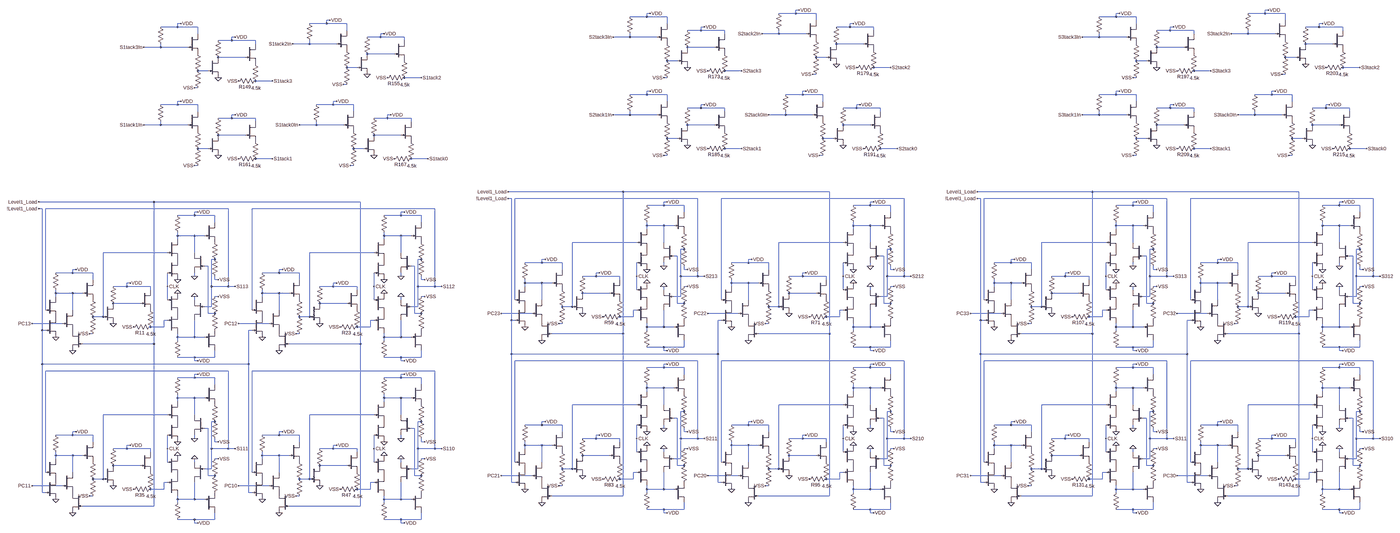
[diagram p0: schematic Level 1.asc, whole sheet]
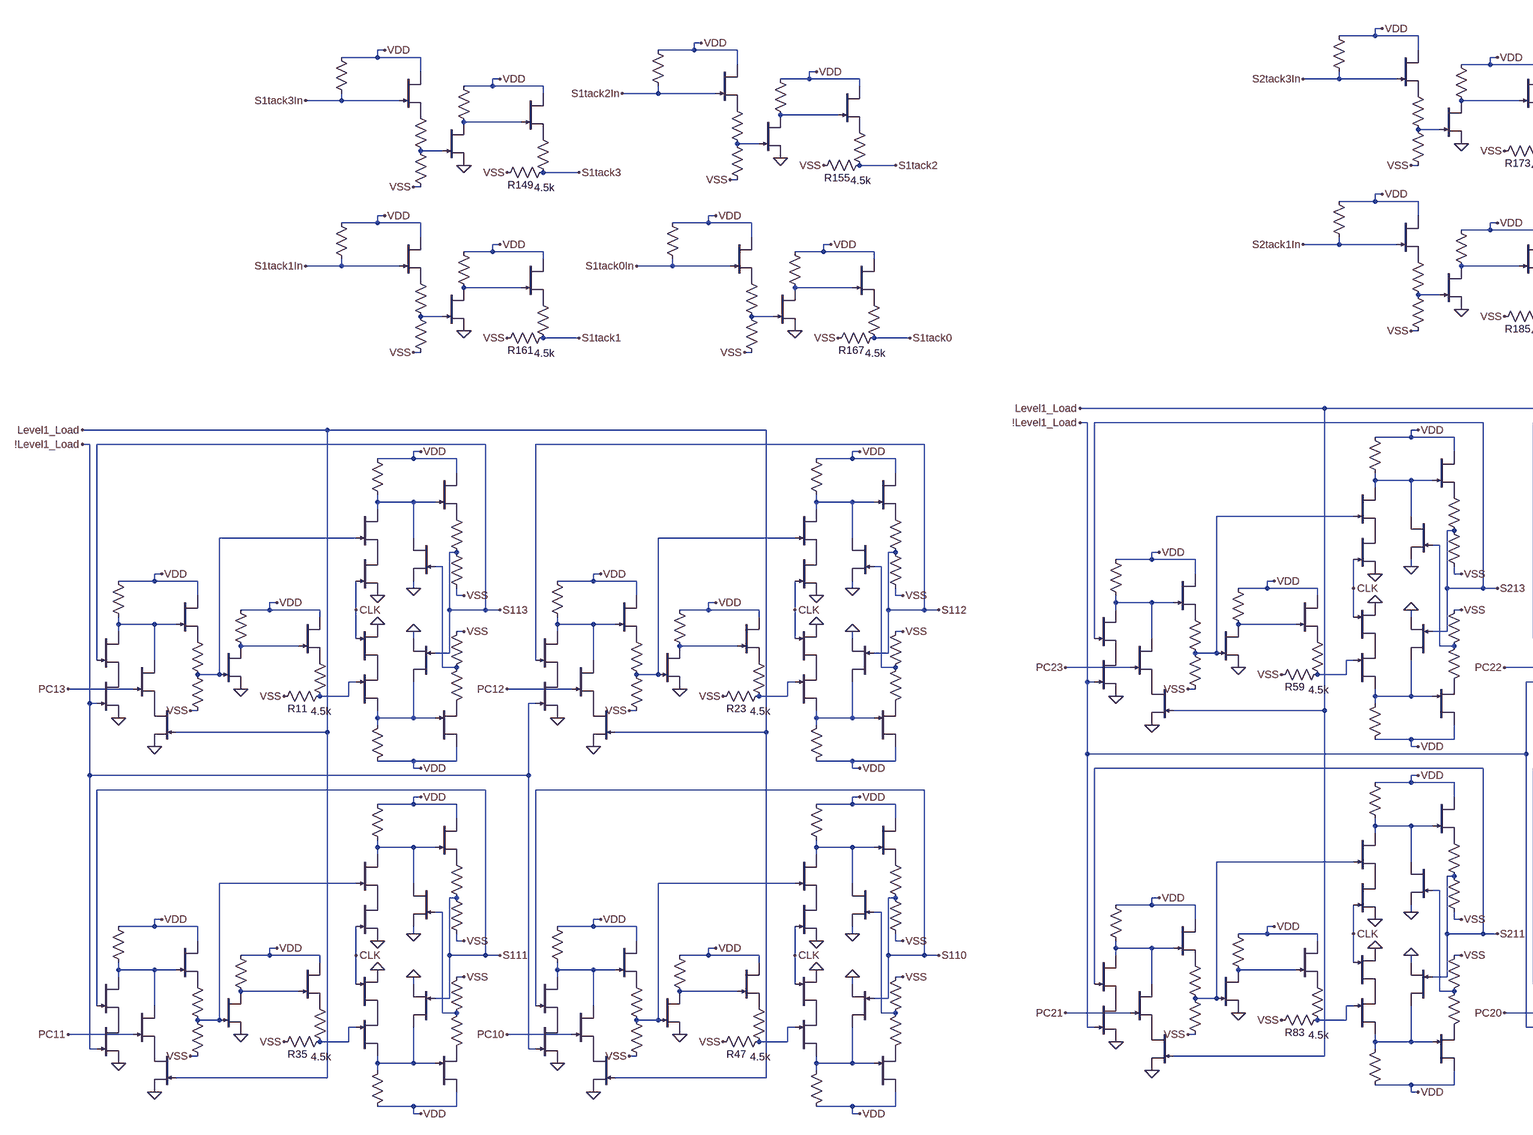
[diagram p1: schematic Level 1.asc, part, row 1 of 1, column 1 of 2]
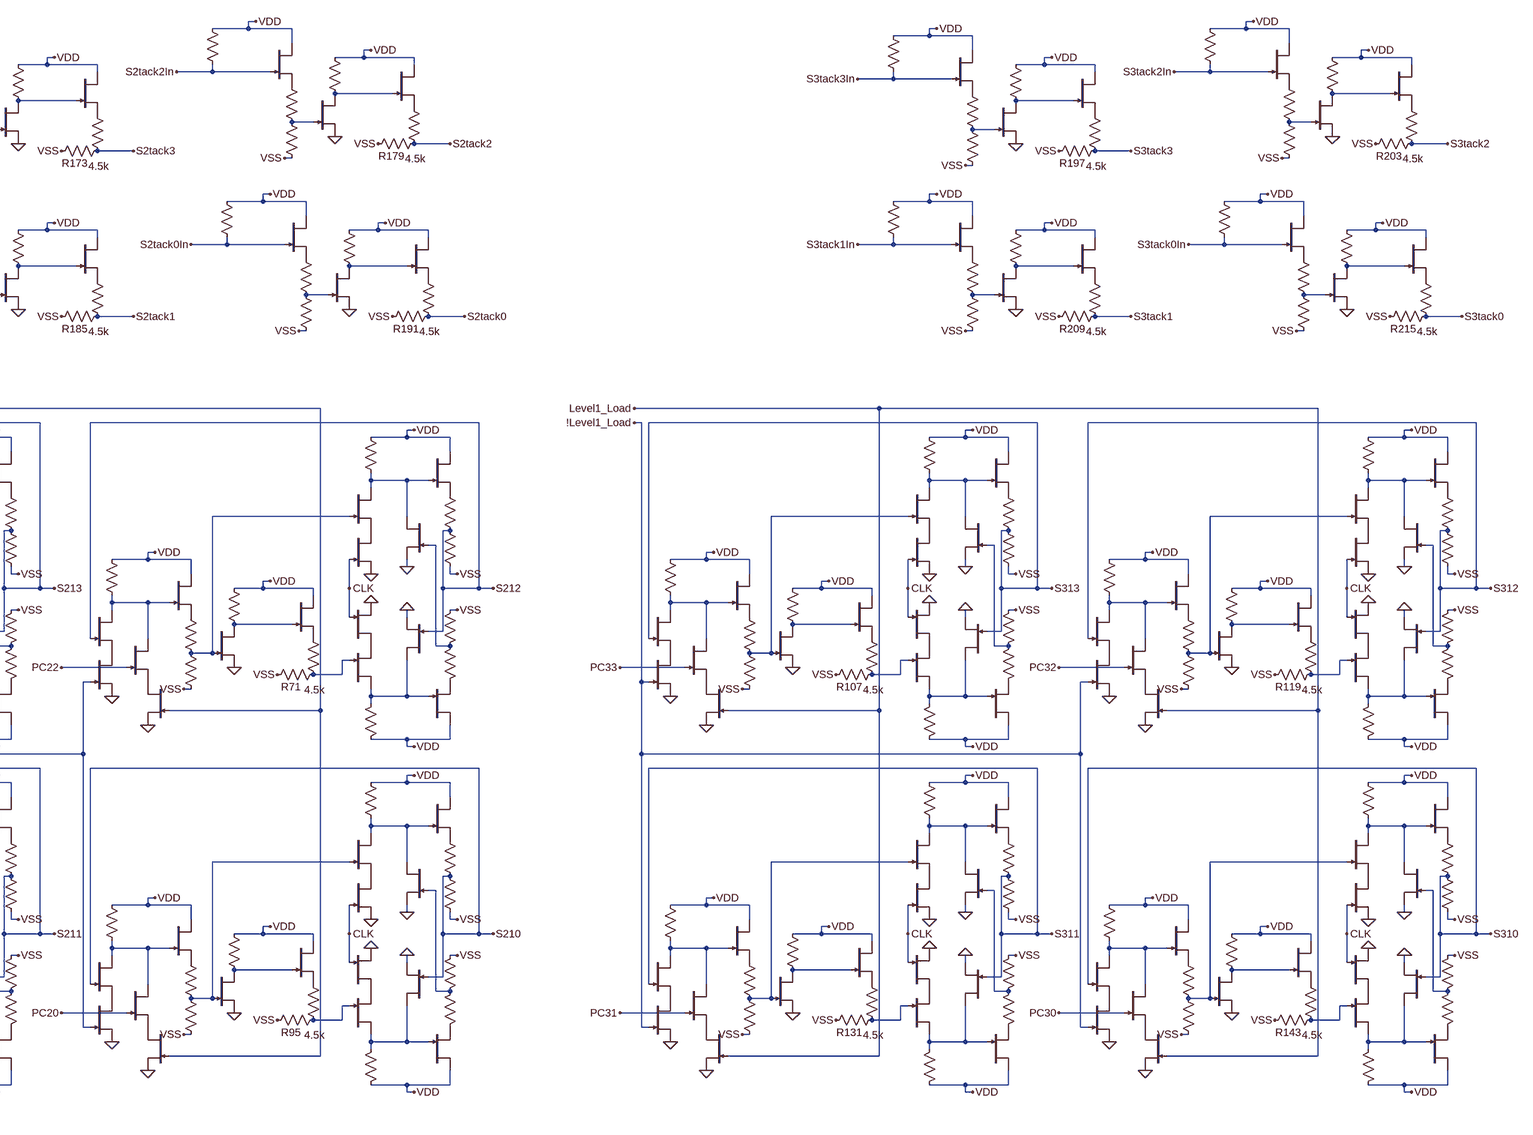
[diagram p2: schematic Level 1.asc, part, row 1 of 1, column 2 of 2]
* Level 1.asc
J0 N029 N035 P001 DR
R0 VDD N029 100k
J1 VDD N029 P002 DR
R1 P002 S113 1k
R2 S113 VSS 4.8k
J2 N029 N041 0 DR
J3 N065 N059 P003 DR
R3 VDD N065 100k
J4 VDD N065 P004 DR
R4 P004 N041 1k
R5 N041 VSS 4.8k
J5 N065 S113 0 DR
J6 P001 CLK 0 DR
J7 P003 CLK 0 DR
J8 N047 S113 P005 DR
R6 VDD N047 100k
J9 VDD N047 P006 DR
R7 P006 N035 1k
R8 N035 VSS 4.8k
J10 N047 PC13 P007 DR
J11 N053 N035 0 DR
R9 VDD N053 50k
J12 VDD N053 P008 DR
R10 P008 N059 1k
R11 N059 VSS 4.5k
J13 P005 !Level1_Load 0 DR
J14 P007 Level1_Load 0 DR
J15 N030 N036 P009 DR
R12 VDD N030 100k
J16 VDD N030 P010 DR
R13 P010 S112 1k
R14 S112 VSS 4.8k
J17 N030 N042 0 DR
J18 N066 N060 P011 DR
R15 VDD N066 100k
J19 VDD N066 P012 DR
R16 P012 N042 1k
R17 N042 VSS 4.8k
J20 N066 S112 0 DR
J21 P009 CLK 0 DR
J22 P011 CLK 0 DR
J23 N048 S112 P013 DR
R18 VDD N048 100k
J24 VDD N048 P014 DR
R19 P014 N036 1k
R20 N036 VSS 4.8k
J25 N048 PC12 P015 DR
J26 N054 N036 0 DR
R21 VDD N054 50k
J27 VDD N054 P016 DR
R22 P016 N060 1k
R23 N060 VSS 4.5k
J28 P013 !Level1_Load 0 DR
J29 P015 Level1_Load 0 DR
J30 N071 N077 P017 DR
R24 VDD N071 100k
J31 VDD N071 P018 DR
R25 P018 S111 1k
R26 S111 VSS 4.8k
J32 N071 N083 0 DR
J33 N107 N101 P019 DR
R27 VDD N107 100k
J34 VDD N107 P020 DR
R28 P020 N083 1k
R29 N083 VSS 4.8k
J35 N107 S111 0 DR
J36 P017 CLK 0 DR
J37 P019 CLK 0 DR
J38 N089 S111 P021 DR
R30 VDD N089 100k
J39 VDD N089 P022 DR
R31 P022 N077 1k
R32 N077 VSS 4.8k
J40 N089 PC11 P023 DR
J41 N095 N077 0 DR
R33 VDD N095 50k
J42 VDD N095 P024 DR
R34 P024 N101 1k
R35 N101 VSS 4.5k
J43 P021 !Level1_Load 0 DR
J44 P023 Level1_Load 0 DR
J45 N072 N078 P025 DR
R36 VDD N072 100k
J46 VDD N072 P026 DR
R37 P026 S110 1k
R38 S110 VSS 4.8k
J47 N072 N084 0 DR
J48 N108 N102 P027 DR
R39 VDD N108 100k
J49 VDD N108 P028 DR
R40 P028 N084 1k
R41 N084 VSS 4.8k
J50 N108 S110 0 DR
J51 P025 CLK 0 DR
J52 P027 CLK 0 DR
J53 N090 S110 P029 DR
R42 VDD N090 100k
J54 VDD N090 P030 DR
R43 P030 N078 1k
R44 N078 VSS 4.8k
J55 N090 PC10 P031 DR
J56 N096 N078 0 DR
R45 VDD N096 50k
J57 VDD N096 P032 DR
R46 P032 N102 1k
R47 N102 VSS 4.5k
J58 P029 !Level1_Load 0 DR
J59 P031 Level1_Load 0 DR
J60 N025 N031 P033 DR
R48 VDD N025 100k
J61 VDD N025 P034 DR
R49 P034 S213 1k
R50 S213 VSS 4.8k
J62 N025 N037 0 DR
J63 N061 N055 P035 DR
R51 VDD N061 100k
J64 VDD N061 P036 DR
R52 P036 N037 1k
R53 N037 VSS 4.8k
J65 N061 S213 0 DR
J66 P033 CLK 0 DR
J67 P035 CLK 0 DR
J68 N043 S213 P037 DR
R54 VDD N043 100k
J69 VDD N043 P038 DR
R55 P038 N031 1k
R56 N031 VSS 4.8k
J70 N043 PC23 P039 DR
J71 N049 N031 0 DR
R57 VDD N049 50k
J72 VDD N049 P040 DR
R58 P040 N055 1k
R59 N055 VSS 4.5k
J73 P037 !Level1_Load 0 DR
J74 P039 Level1_Load 0 DR
J75 N026 N032 P041 DR
R60 VDD N026 100k
J76 VDD N026 P042 DR
R61 P042 S212 1k
R62 S212 VSS 4.8k
J77 N026 N038 0 DR
J78 N062 N056 P043 DR
R63 VDD N062 100k
J79 VDD N062 P044 DR
R64 P044 N038 1k
R65 N038 VSS 4.8k
J80 N062 S212 0 DR
J81 P041 CLK 0 DR
J82 P043 CLK 0 DR
J83 N044 S212 P045 DR
R66 VDD N044 100k
J84 VDD N044 P046 DR
R67 P046 N032 1k
R68 N032 VSS 4.8k
J85 N044 PC22 P047 DR
J86 N050 N032 0 DR
R69 VDD N050 50k
J87 VDD N050 P048 DR
R70 P048 N056 1k
R71 N056 VSS 4.5k
J88 P045 !Level1_Load 0 DR
J89 P047 Level1_Load 0 DR
J90 N067 N073 P049 DR
R72 VDD N067 100k
J91 VDD N067 P050 DR
R73 P050 S211 1k
R74 S211 VSS 4.8k
J92 N067 N079 0 DR
J93 N103 N097 P051 DR
R75 VDD N103 100k
J94 VDD N103 P052 DR
R76 P052 N079 1k
R77 N079 VSS 4.8k
J95 N103 S211 0 DR
J96 P049 CLK 0 DR
J97 P051 CLK 0 DR
J98 N085 S211 P053 DR
R78 VDD N085 100k
J99 VDD N085 P054 DR
R79 P054 N073 1k
R80 N073 VSS 4.8k
J100 N085 PC21 P055 DR
J101 N091 N073 0 DR
R81 VDD N091 50k
J102 VDD N091 P056 DR
R82 P056 N097 1k
R83 N097 VSS 4.5k
J103 P053 !Level1_Load 0 DR
J104 P055 Level1_Load 0 DR
J105 N068 N074 P057 DR
R84 VDD N068 100k
J106 VDD N068 P058 DR
R85 P058 S210 1k
R86 S210 VSS 4.8k
J107 N068 N080 0 DR
J108 N104 N098 P059 DR
R87 VDD N104 100k
J109 VDD N104 P060 DR
R88 P060 N080 1k
R89 N080 VSS 4.8k
J110 N104 S210 0 DR
J111 P057 CLK 0 DR
J112 P059 CLK 0 DR
J113 N086 S210 P061 DR
R90 VDD N086 100k
J114 VDD N086 P062 DR
R91 P062 N074 1k
R92 N074 VSS 4.8k
J115 N086 PC20 P063 DR
J116 N092 N074 0 DR
R93 VDD N092 50k
J117 VDD N092 P064 DR
R94 P064 N098 1k
R95 N098 VSS 4.5k
J118 P061 !Level1_Load 0 DR
J119 P063 Level1_Load 0 DR
J120 N027 N033 P065 DR
R96 VDD N027 100k
J121 VDD N027 P066 DR
R97 P066 S313 1k
R98 S313 VSS 4.8k
J122 N027 N039 0 DR
J123 N063 N057 P067 DR
R99 VDD N063 100k
J124 VDD N063 P068 DR
R100 P068 N039 1k
R101 N039 VSS 4.8k
J125 N063 S313 0 DR
J126 P065 CLK 0 DR
J127 P067 CLK 0 DR
J128 N045 S313 P069 DR
R102 VDD N045 100k
J129 VDD N045 P070 DR
R103 P070 N033 1k
R104 N033 VSS 4.8k
J130 N045 PC33 P071 DR
J131 N051 N033 0 DR
R105 VDD N051 50k
J132 VDD N051 P072 DR
R106 P072 N057 1k
R107 N057 VSS 4.5k
J133 P069 !Level1_Load 0 DR
J134 P071 Level1_Load 0 DR
J135 N028 N034 P073 DR
R108 VDD N028 100k
J136 VDD N028 P074 DR
R109 P074 S312 1k
R110 S312 VSS 4.8k
J137 N028 N040 0 DR
J138 N064 N058 P075 DR
R111 VDD N064 100k
J139 VDD N064 P076 DR
R112 P076 N040 1k
R113 N040 VSS 4.8k
J140 N064 S312 0 DR
J141 P073 CLK 0 DR
J142 P075 CLK 0 DR
J143 N046 S312 P077 DR
R114 VDD N046 100k
J144 VDD N046 P078 DR
R115 P078 N034 1k
R116 N034 VSS 4.8k
J145 N046 PC32 P079 DR
J146 N052 N034 0 DR
R117 VDD N052 50k
J147 VDD N052 P080 DR
R118 P080 N058 1k
R119 N058 VSS 4.5k
J148 P077 !Level1_Load 0 DR
J149 P079 Level1_Load 0 DR
J150 N069 N075 P081 DR
R120 VDD N069 100k
J151 VDD N069 P082 DR
R121 P082 S311 1k
R122 S311 VSS 4.8k
J152 N069 N081 0 DR
J153 N105 N099 P083 DR
R123 VDD N105 100k
J154 VDD N105 P084 DR
R124 P084 N081 1k
R125 N081 VSS 4.8k
J155 N105 S311 0 DR
J156 P081 CLK 0 DR
J157 P083 CLK 0 DR
J158 N087 S311 P085 DR
R126 VDD N087 100k
J159 VDD N087 P086 DR
R127 P086 N075 1k
R128 N075 VSS 4.8k
J160 N087 PC31 P087 DR
J161 N093 N075 0 DR
R129 VDD N093 50k
J162 VDD N093 P088 DR
R130 P088 N099 1k
R131 N099 VSS 4.5k
J163 P085 !Level1_Load 0 DR
J164 P087 Level1_Load 0 DR
J165 N070 N076 P089 DR
R132 VDD N070 100k
J166 VDD N070 P090 DR
R133 P090 S310 1k
R134 S310 VSS 4.8k
J167 N070 N082 0 DR
J168 N106 N100 P091 DR
R135 VDD N106 100k
J169 VDD N106 P092 DR
R136 P092 N082 1k
R137 N082 VSS 4.8k
J170 N106 S310 0 DR
J171 P089 CLK 0 DR
J172 P091 CLK 0 DR
J173 N088 S310 P093 DR
R138 VDD N088 100k
J174 VDD N088 P094 DR
R139 P094 N076 1k
R140 N076 VSS 4.8k
J175 N088 PC30 P095 DR
J176 N094 N076 0 DR
R141 VDD N094 50k
J177 VDD N094 P096 DR
R142 P096 N100 1k
R143 N100 VSS 4.5k
J178 P093 !Level1_Load 0 DR
J179 P095 Level1_Load 0 DR
R144 VDD S1tack3In 100k
J180 VDD S1tack3In P097 DR
R145 P097 N012 1k
R146 N012 VSS 4.8k
J181 N006 N012 0 DR
R147 VDD N006 50k
J182 VDD N006 P098 DR
R148 P098 S1tack3 1k
R149 S1tack3 VSS 4.5k
R150 VDD S1tack2In 100k
J183 VDD S1tack2In P099 DR
R151 P099 N011 1k
R152 N011 VSS 4.8k
J184 N005 N011 0 DR
R153 VDD N005 50k
J185 VDD N005 P100 DR
R154 P100 S1tack2 1k
R155 S1tack2 VSS 4.5k
R156 VDD S1tack1In 100k
J186 VDD S1tack1In P101 DR
R157 P101 N023 1k
R158 N023 VSS 4.8k
J187 N017 N023 0 DR
R159 VDD N017 50k
J188 VDD N017 P102 DR
R160 P102 S1tack1 1k
R161 S1tack1 VSS 4.5k
R162 VDD S1tack0In 100k
J189 VDD S1tack0In P103 DR
R163 P103 N024 1k
R164 N024 VSS 4.8k
J190 N018 N024 0 DR
R165 VDD N018 50k
J191 VDD N018 P104 DR
R166 P104 S1tack0 1k
R167 S1tack0 VSS 4.5k
R168 VDD S2tack3In 100k
J192 VDD S2tack3In P105 DR
R169 P105 N009 1k
R170 N009 VSS 4.8k
J193 N003 N009 0 DR
R171 VDD N003 50k
J194 VDD N003 P106 DR
R172 P106 S2tack3 1k
R173 S2tack3 VSS 4.5k
R174 VDD S2tack2In 100k
J195 VDD S2tack2In P107 DR
R175 P107 N007 1k
R176 N007 VSS 4.8k
J196 N001 N007 0 DR
R177 VDD N001 50k
J197 VDD N001 P108 DR
R178 P108 S2tack2 1k
R179 S2tack2 VSS 4.5k
R180 VDD S2tack1In 100k
J198 VDD S2tack1In P109 DR
R181 P109 N019 1k
R182 N019 VSS 4.8k
J199 N013 N019 0 DR
R183 VDD N013 50k
J200 VDD N013 P110 DR
R184 P110 S2tack1 1k
R185 S2tack1 VSS 4.5k
R186 VDD S2tack0In 100k
J201 VDD S2tack0In P111 DR
R187 P111 N020 1k
R188 N020 VSS 4.8k
J202 N014 N020 0 DR
R189 VDD N014 50k
J203 VDD N014 P112 DR
R190 P112 S2tack0 1k
R191 S2tack0 VSS 4.5k
R192 VDD S3tack3In 100k
J204 VDD S3tack3In P113 DR
R193 P113 N010 1k
R194 N010 VSS 4.8k
J205 N004 N010 0 DR
R195 VDD N004 50k
J206 VDD N004 P114 DR
R196 P114 S3tack3 1k
R197 S3tack3 VSS 4.5k
R198 VDD S3tack2In 100k
J207 VDD S3tack2In P115 DR
R199 P115 N008 1k
R200 N008 VSS 4.8k
J208 N002 N008 0 DR
R201 VDD N002 50k
J209 VDD N002 P116 DR
R202 P116 S3tack2 1k
R203 S3tack2 VSS 4.5k
R204 VDD S3tack1In 100k
J210 VDD S3tack1In P117 DR
R205 P117 N021 1k
R206 N021 VSS 4.8k
J211 N015 N021 0 DR
R207 VDD N015 50k
J212 VDD N015 P118 DR
R208 P118 S3tack1 1k
R209 S3tack1 VSS 4.5k
R210 VDD S3tack0In 100k
J213 VDD S3tack0In P119 DR
R211 P119 N022 1k
R212 N022 VSS 4.8k
J214 N016 N022 0 DR
R213 VDD N016 50k
J215 VDD N016 P120 DR
R214 P120 S3tack0 1k
R215 S3tack0 VSS 4.5k
.model NJF NJF
.model PJF PJF
.lib standard.jft
.backanno
.end